# EAGLE schematic V1.0.1 (EAGLE 6.6.0)
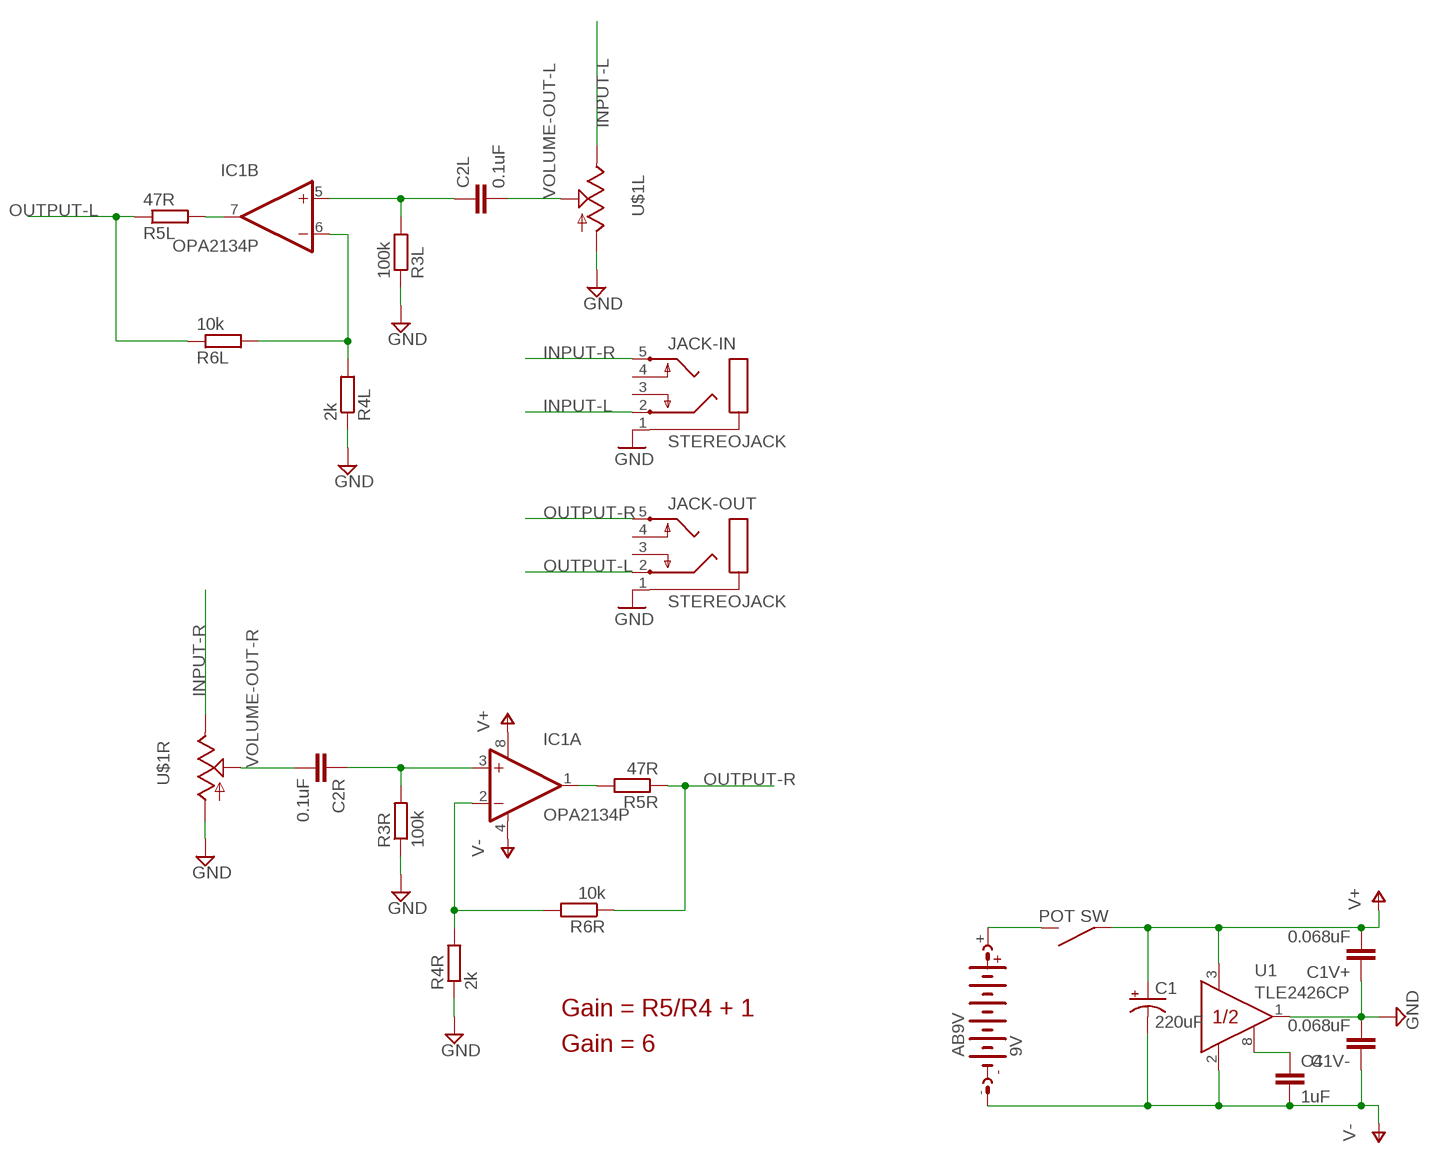
[diagram p0: schematic, sheet 1]

## Parts
9V  AB9V  [AB9V]
C1  220uF  CPOL-USE3.5-8  [E3,5-8]
C1V+  0.068uF  C2.5/2  [C2.5-2]
C1V-  0.068uF  C2.5/2  [C2.5-2]
C2L  0.1uF  C5/5  [C5B5]
C2R  0.1uF  C5/5  [C5B5]
C4  1uF  C5/2.5  [C5B2.5]
IC1  OPA2134P  [DIL-8]
JACK-IN  STEREOJACK  [STX3100]
JACK-OUT  STEREOJACK  [STX3100]
R3L  100k  R-EU_0207/2V  [0207/2V]
R3R  100k  R-EU_0207/2V  [0207/2V]
R4L  2k  R-EU_0207/2V  [0207/2V]
R4R  2k  R-EU_0207/2V  [0207/2V]
R5L  47R  R-EU_0207/2V  [0207/2V]
R5R  47R  R-EU_0207/2V  [0207/2V]
R6L  10k  R-EU_0207/2V  [0207/2V]
R6R  10k  R-EU_0207/2V  [0207/2V]
U1  TLE2426CP  [DIP-8]
U$1  ALPS_RK0971221Z05  [ALPS_RK0971221Z0X]

## Nets
GND: C1V+.1 C1V-.2 JACK-IN.1 JACK-OUT.1 R3L.1 R3R.1 R4L.1 R4R.1 U1.1(OUT) U$1.G1 U$1.G2
INPUT-L: JACK-IN.2 U$1.I1
INPUT-R: JACK-IN.5 U$1.I2
L+: C2L.1 IC1.5(B:+IN) R3L.2
L-: IC1.6(B:-IN) R4L.2 R6L.2
N$2: 9V.+ U$1.S2
N$13: C4.1 U1.8(NR)
OP-L: IC1.7(B:OUT) R5L.2
OP-R: IC1.1(A:OUT) R5R.2
OUTPUT-L: JACK-OUT.2 R5L.1 R6L.1
OUTPUT-R: JACK-OUT.5 R5R.1 R6R.1
R+: C2R.1 IC1.3(A:+IN) R3R.2
R-: IC1.2(A:-IN) R4R.2 R6R.2
V+: C1.+ C1V+.2 IC1.8(A:V+) U1.3(IN) U$1.S1
V-: 9V.- C1.- C1V-.1 C4.2 IC1.4(A:V-) U1.2(COM)
VOLUME-OUT-L: C2L.2 U$1.O1
VOLUME-OUT-R: C2R.2 U$1.O2
Unconnected: JACK-IN.3 JACK-IN.4 JACK-OUT.3 JACK-OUT.4

## Notes on the sheet
- Gain = R5/R4 + 1
- Gain = 6

## Library data of the parts
9V = battery:AB9V: 9-V BATTERY CLIP
C1 = rcl:CPOL-US: POLARIZED CAPACITOR, American symbol
C1V+ C1V- C2L C2R C4 = capacitor-wima:C: CAPACITOR naming: grid - package width
IC1 = akafugu:OPA2134: Operational Amplifier
JACK-IN JACK-OUT = akafugu:STEREOJACK: MIC/HEADPHONE JACK Stereo jack with two switches. Kycon STX3100, CUI SJ1-3555NG and/or 4UCon 05544
R3L R3R R4L R4R R5L R5R R6L R6R = resistor:R-EU_: RESISTOR, European symbol
U1 = tle2426:TLE2426*: Texas Instruments "rail splitter" with noise-reduction
U$1 = audio-pots:ALPS_RK0971221Z0*: ALPS RK0971221Z Dual-gang 9mm potentiometer for volume control, with SPST switch -05 model: 10K with "volume" taper -0N model: 50K with traditional audio taper

## Net classes
0 default: width 0.254 mm, drill 0.305 mm, clearance 0.152 mm